# Altium schematic sheet BPC.ProbeV1.SchDoc
size 420 x 297 mm; Address1: Address1; Address2: Address2; Address3: Address3; Address4: Address4; SheetNumber: 1; Scale: 1:1; Разраб.: Иванов; Обозначение документа: АБВГ.123456.001 Э3; Пров.: Петров; Утв.: Сидоров; Наименование организации: ОАО "Концерн "МПО-Гидроприбор"; Перв. применение: АБВГ.123456.000; Наименование изделия 1: Плата; Наименование изделия 2: Схема электрическая; Наименование изделия 3: принципиальная; Нач. отд.: Нач. отд.; Фамилия нач. отд.: Сидоров
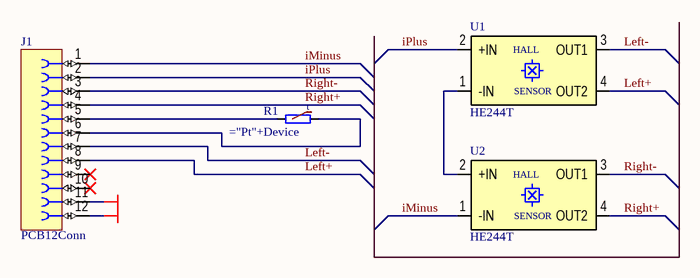
[diagram p0: BPC.ProbeV1.SchDoc]

## Parts
J1  PCB12Conn  [PCB12Conn]
R1  (no value)  [HRTS-5760-B-U-0-12mini]
U1  HE244T  [HE244T_LeftV1]
U2  HE244T  [HE244T_RightV1]

## Nets
GND: J1.11 J1.12
iMinus: J1.1 U2.1(-IN)
iPlus: J1.2 U1.2(+IN)
Left+: J1.8 U1.4(OUT2)
Left-: J1.7 U1.3(OUT1)
Right+: J1.4 U2.4(OUT2)
Right-: J1.3 U2.3(OUT1)
NetJ1_5: J1.5 R1.1
NetJ1_6: J1.6 R1.2
NetU1_1: U1.1(-IN) U2.2(+IN)

Not connected (* = marked no-connect by the designer): J1 9* 10*

## Notes on the sheet
- Перв. примен.
- Справ. №
- Подп. и дата
- Инв. № дубл.
- Взам. инв. №
- Разраб.
- Изм.
- Лист
- № докум.
- Подп.
- Дата
- Лит.
- Масса
- Масштаб
- Пров.
- Т.контр.
- Листов
- Инв. № подл.
- Утв.
- Н.контр.
- Копировал
- Формат А3
- (in symbol HE244T) HALL; SENSOR
- (in symbol HRTS-5760-B-U-0-12) t

## Library data of the parts
J1 = PCB12_Conn: PCB Connector 12 pins; Vendor: PSElectro; SMD Solders: 0; Solder Option: RM; THD Solders: 14; Price: 0; Pkg: PCB12Conn; Device: PCB12Conn
R1 = HRTS-5760-B-U-0-12: Pt1000 Temperature Sensors; Vendor: HoneyWell; Value: 1000; SMD Solders: 0; Solder Option: RM; THD Solders: 2; Pkg: HRTS-5760-B-U-0-12; Price: 16000; Device: HRTS-5760-B-U-0-12; Name to order: HRTS-5760-B-U-0-12
U1 U2 = HE244T: HE244 Series Analog Hall Sensor; Vendor: Advanced Sensor Tech.; Value: 2mA; Pkg: НЕ244T; SMD Solders: 0; Solder Option: RM; THD Solders: 4; Price: 20000; Device: HE244T